# EAGLE schematic breakout (EAGLE 7.2.0)
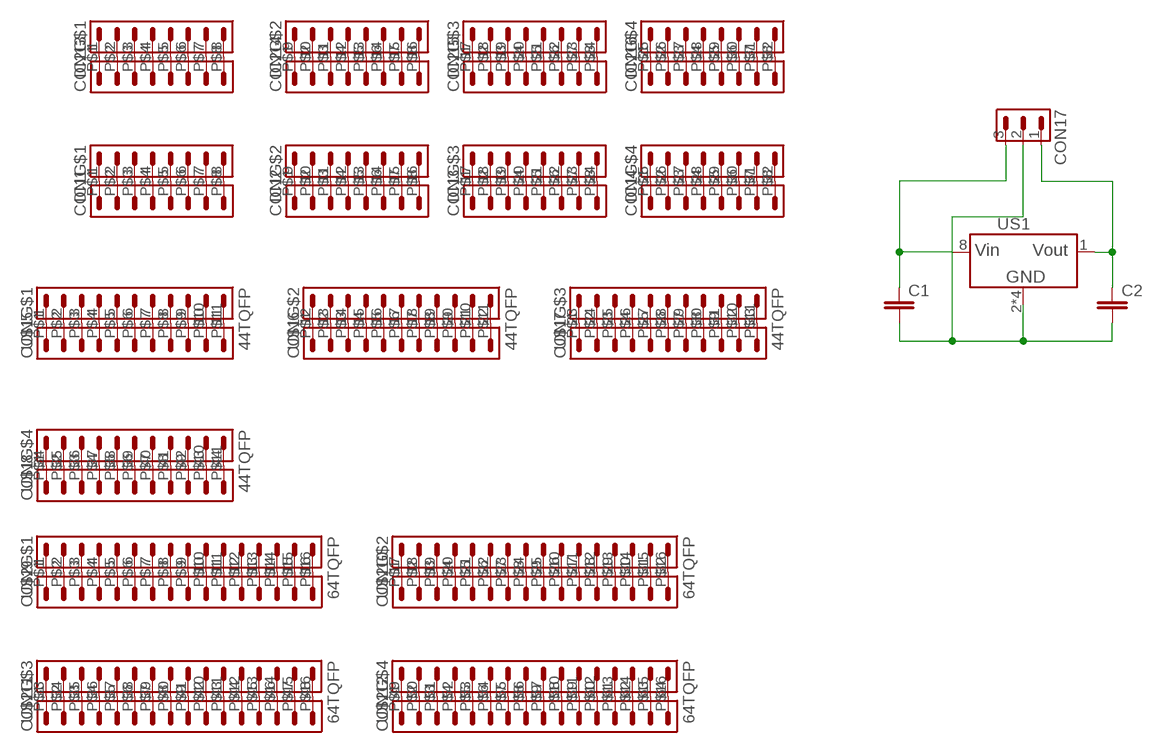
[diagram p0: schematic, sheet 1]

## Parts
C1  C0603  [0603]
C2  C0603  [0603]
CON1  PIN8X1_SM50  [PIN8X1_SM50]
CON2  PIN8X1_SM50  [PIN8X1_SM50]
CON3  PIN8X1_SM50  [PIN8X1_SM50]
CON4  PIN8X1_SM50  [PIN8X1_SM50]
CON5  PIN11X1_SM50  [PIN11X1_SM50]
CON6  PIN11X1_SM50  [PIN11X1_SM50]
CON7  PIN11X1_SM50  [PIN11X1_SM50]
CON8  PIN11X1_SM50  [PIN11X1_SM50]
CON9  PIN16X1_SM50  [PIN16X1_SM50]
CON10  PIN16X1_SM50  [PIN16X1_SM50]
CON11  PIN16X1_SM50  [PIN16X1_SM50]
CON12  PIN16X1_SM50  [PIN16X1_SM50]
CON13  PIN8X1_SM50  [PIN8X1_SM50]
CON14  PIN8X1_SM50  [PIN8X1_SM50]
CON15  PIN8X1_SM50  [PIN8X1_SM50]
CON16  PIN8X1_SM50  [PIN8X1_SM50]
CON17  PIN3X1  [PIN3X1]
IC1  32TQFP  [TQFP32]
IC2  32MLF  [MLF32-TH]
U$1  44TQFP  [TQFP44]
U$2  64TQFP  [TQFP64]
US1  VREG+L-SO8  [SO08]

## Nets
N$1: CON1.P$1 IC1.1
N$2: CON1.P$2 IC1.2
N$3: CON1.P$3 IC1.3
N$4: CON1.P$4 IC1.4
N$5: CON1.P$5 IC1.5
N$6: CON1.P$6 IC1.6
N$7: CON1.P$7 IC1.7
N$8: CON1.P$8 IC1.8
N$9: CON2.P$1 IC1.9
N$10: CON2.P$2 IC1.10
N$11: CON2.P$3 IC1.11
N$12: CON2.P$4 IC1.12
N$13: CON2.P$5 IC1.13
N$14: CON2.P$6 IC1.14
N$15: CON2.P$7 IC1.15
N$16: CON2.P$8 IC1.16
N$17: CON3.P$1 IC1.17
N$18: CON3.P$2 IC1.18
N$19: CON3.P$3 IC1.19
N$20: CON3.P$4 IC1.20
N$21: CON3.P$5 IC1.21
N$22: CON3.P$6 IC1.22
N$23: CON3.P$7 IC1.23
N$24: CON3.P$8 IC1.24
N$25: CON4.P$1 IC1.25
N$26: CON4.P$2 IC1.26
N$27: CON4.P$3 IC1.27
N$28: CON4.P$4 IC1.28
N$29: CON4.P$5 IC1.29
N$30: CON4.P$6 IC1.30
N$31: CON4.P$7 IC1.31
N$32: CON4.P$8 IC1.32
N$33: CON5.P$1 U$1.1
N$34: CON5.P$2 U$1.2
N$35: CON5.P$3 U$1.3
N$36: CON5.P$4 U$1.4
N$37: CON5.P$5 U$1.5
N$38: CON5.P$6 U$1.6
N$39: CON5.P$7 U$1.7
N$40: CON5.P$8 U$1.8
N$41: CON5.P$9 U$1.9
N$42: CON5.P$10 U$1.10
N$43: CON5.P$11 U$1.11
N$44: CON6.P$1 U$1.12
N$45: CON6.P$2 U$1.13
N$46: CON6.P$3 U$1.14
N$47: CON6.P$4 U$1.15
N$48: CON6.P$5 U$1.16
N$49: CON6.P$6 U$1.17
N$50: CON6.P$7 U$1.18
N$51: CON6.P$8 U$1.19
N$52: CON6.P$9 U$1.20
N$53: CON6.P$10 U$1.21
N$54: CON6.P$11 U$1.22
N$55: CON7.P$1 U$1.23
N$56: CON7.P$2 U$1.24
N$57: CON7.P$3 U$1.25
N$58: CON7.P$4 U$1.26
N$59: CON7.P$5 U$1.27
N$60: CON7.P$6 U$1.28
N$61: CON7.P$7 U$1.29
N$62: CON7.P$8 U$1.30
N$63: CON7.P$9 U$1.31
N$64: CON7.P$10 U$1.32
N$65: CON7.P$11 U$1.33
N$66: CON8.P$1 U$1.34
N$67: CON8.P$2 U$1.35
N$68: CON8.P$3 U$1.36
N$69: CON8.P$4 U$1.37
N$70: CON8.P$5 U$1.38
N$71: CON8.P$6 U$1.39
N$72: CON8.P$7 U$1.40
N$73: CON8.P$8 U$1.41
N$74: CON8.P$9 U$1.42
N$75: CON8.P$10 U$1.43
N$76: CON8.P$11 U$1.44
N$77: CON9.P$1 U$2.1
N$78: CON9.P$2 U$2.2
N$79: CON9.P$3 U$2.3
N$80: CON9.P$4 U$2.4
N$81: CON9.P$5 U$2.5
N$82: CON9.P$6 U$2.6
N$83: CON9.P$7 U$2.7
N$84: CON9.P$8 U$2.8
N$85: CON9.P$9 U$2.9
N$86: CON9.P$10 U$2.10
N$87: CON9.P$11 U$2.11
N$88: CON9.P$12 U$2.12
N$89: CON9.P$13 U$2.13
N$90: CON9.P$14 U$2.14
N$91: CON9.P$15 U$2.15
N$92: CON9.P$16 U$2.16
N$93: CON10.P$1 U$2.17
N$94: CON10.P$2 U$2.18
N$95: CON10.P$3 U$2.19
N$96: CON10.P$4 U$2.20
N$97: CON10.P$5 U$2.21
N$98: CON10.P$6 U$2.22
N$99: CON10.P$7 U$2.23
N$100: CON10.P$8 U$2.24
N$101: CON10.P$9 U$2.25
N$102: CON10.P$10 U$2.26
N$103: CON10.P$11 U$2.27
N$104: CON10.P$12 U$2.28
N$105: CON10.P$13 U$2.29
N$106: CON10.P$14 U$2.30
N$107: CON10.P$15 U$2.31
N$108: CON10.P$16 U$2.32
N$109: CON11.P$1 U$2.33
N$110: CON11.P$2 U$2.34
N$111: CON11.P$3 U$2.35
N$112: CON11.P$4 U$2.36
N$113: CON11.P$5 U$2.37
N$114: CON11.P$6 U$2.38
N$115: CON11.P$7 U$2.39
N$116: CON11.P$8 U$2.40
N$117: CON11.P$9 U$2.41
N$118: CON11.P$10 U$2.42
N$119: CON11.P$11 U$2.43
N$120: CON11.P$12 U$2.44
N$121: CON11.P$13 U$2.45
N$122: CON11.P$14 U$2.46
N$123: CON11.P$15 U$2.47
N$124: CON11.P$16 U$2.48
N$125: CON12.P$1 U$2.49
N$126: CON12.P$2 U$2.50
N$127: CON12.P$3 U$2.51
N$128: CON12.P$4 U$2.52
N$129: CON12.P$5 U$2.53
N$130: CON12.P$6 U$2.54
N$131: CON12.P$7 U$2.55
N$132: CON12.P$8 U$2.56
N$133: CON12.P$9 U$2.57
N$134: CON12.P$10 U$2.58
N$135: CON12.P$11 U$2.59
N$136: CON12.P$12 U$2.60
N$137: CON12.P$13 U$2.61
N$138: CON12.P$14 U$2.62
N$139: CON12.P$15 U$2.63
N$140: CON12.P$16 U$2.64
N$141: CON13.P$1 IC2.1
N$142: CON13.P$2 IC2.2
N$143: CON13.P$3 IC2.3
N$144: CON13.P$4 IC2.4
N$145: CON13.P$5 IC2.5
N$146: CON13.P$6 IC2.6
N$147: CON13.P$7 IC2.7
N$148: CON13.P$8 IC2.8
N$149: CON14.P$1 IC2.9
N$150: CON14.P$2 IC2.10
N$151: CON14.P$3 IC2.11
N$152: CON14.P$4 IC2.12
N$153: CON14.P$5 IC2.13
N$154: CON14.P$6 IC2.14
N$155: CON14.P$7 IC2.15
N$156: CON14.P$8 IC2.16
N$157: CON15.P$1 IC2.17
N$158: CON15.P$2 IC2.18
N$159: CON15.P$3 IC2.19
N$160: CON15.P$4 IC2.20
N$161: CON15.P$5 IC2.21
N$162: CON15.P$6 IC2.22
N$163: CON15.P$7 IC2.23
N$164: CON15.P$8 IC2.24
N$165: CON16.P$1 IC2.25
N$166: CON16.P$2 IC2.26
N$167: CON16.P$3 IC2.27
N$168: CON16.P$4 IC2.28
N$169: CON16.P$5 IC2.29
N$170: CON16.P$6 IC2.30
N$171: CON16.P$7 IC2.31
N$172: CON16.P$8 IC2.32
N$177: C2.1 CON17.1 US1.1(OUT)
N$178: C1.1 CON17.3 US1.8(IN)
N$179: C1.2 C2.2 CON17.2 US1.2(GND) US1.3(GND) US1.6(GND) US1.7(GND)

## Library data of the parts
C1 C2 = PN_default:C
CON1-CON4 CON13-CON16 = us_obudowy:PIN8X1
CON5-CON8 = us_obudowy:PIN11X1
CON9-CON12 = us_obudowy:PIN16X1
CON17 = pins:PIN3X1
IC1 IC2 = us_obudowy:32
U$1 = us_obudowy:44
U$2 = us_obudowy:64
US1 = semiconductors:VREG+